# EAGLE design Qwiic_ADC (EAGLE 9.0.1)
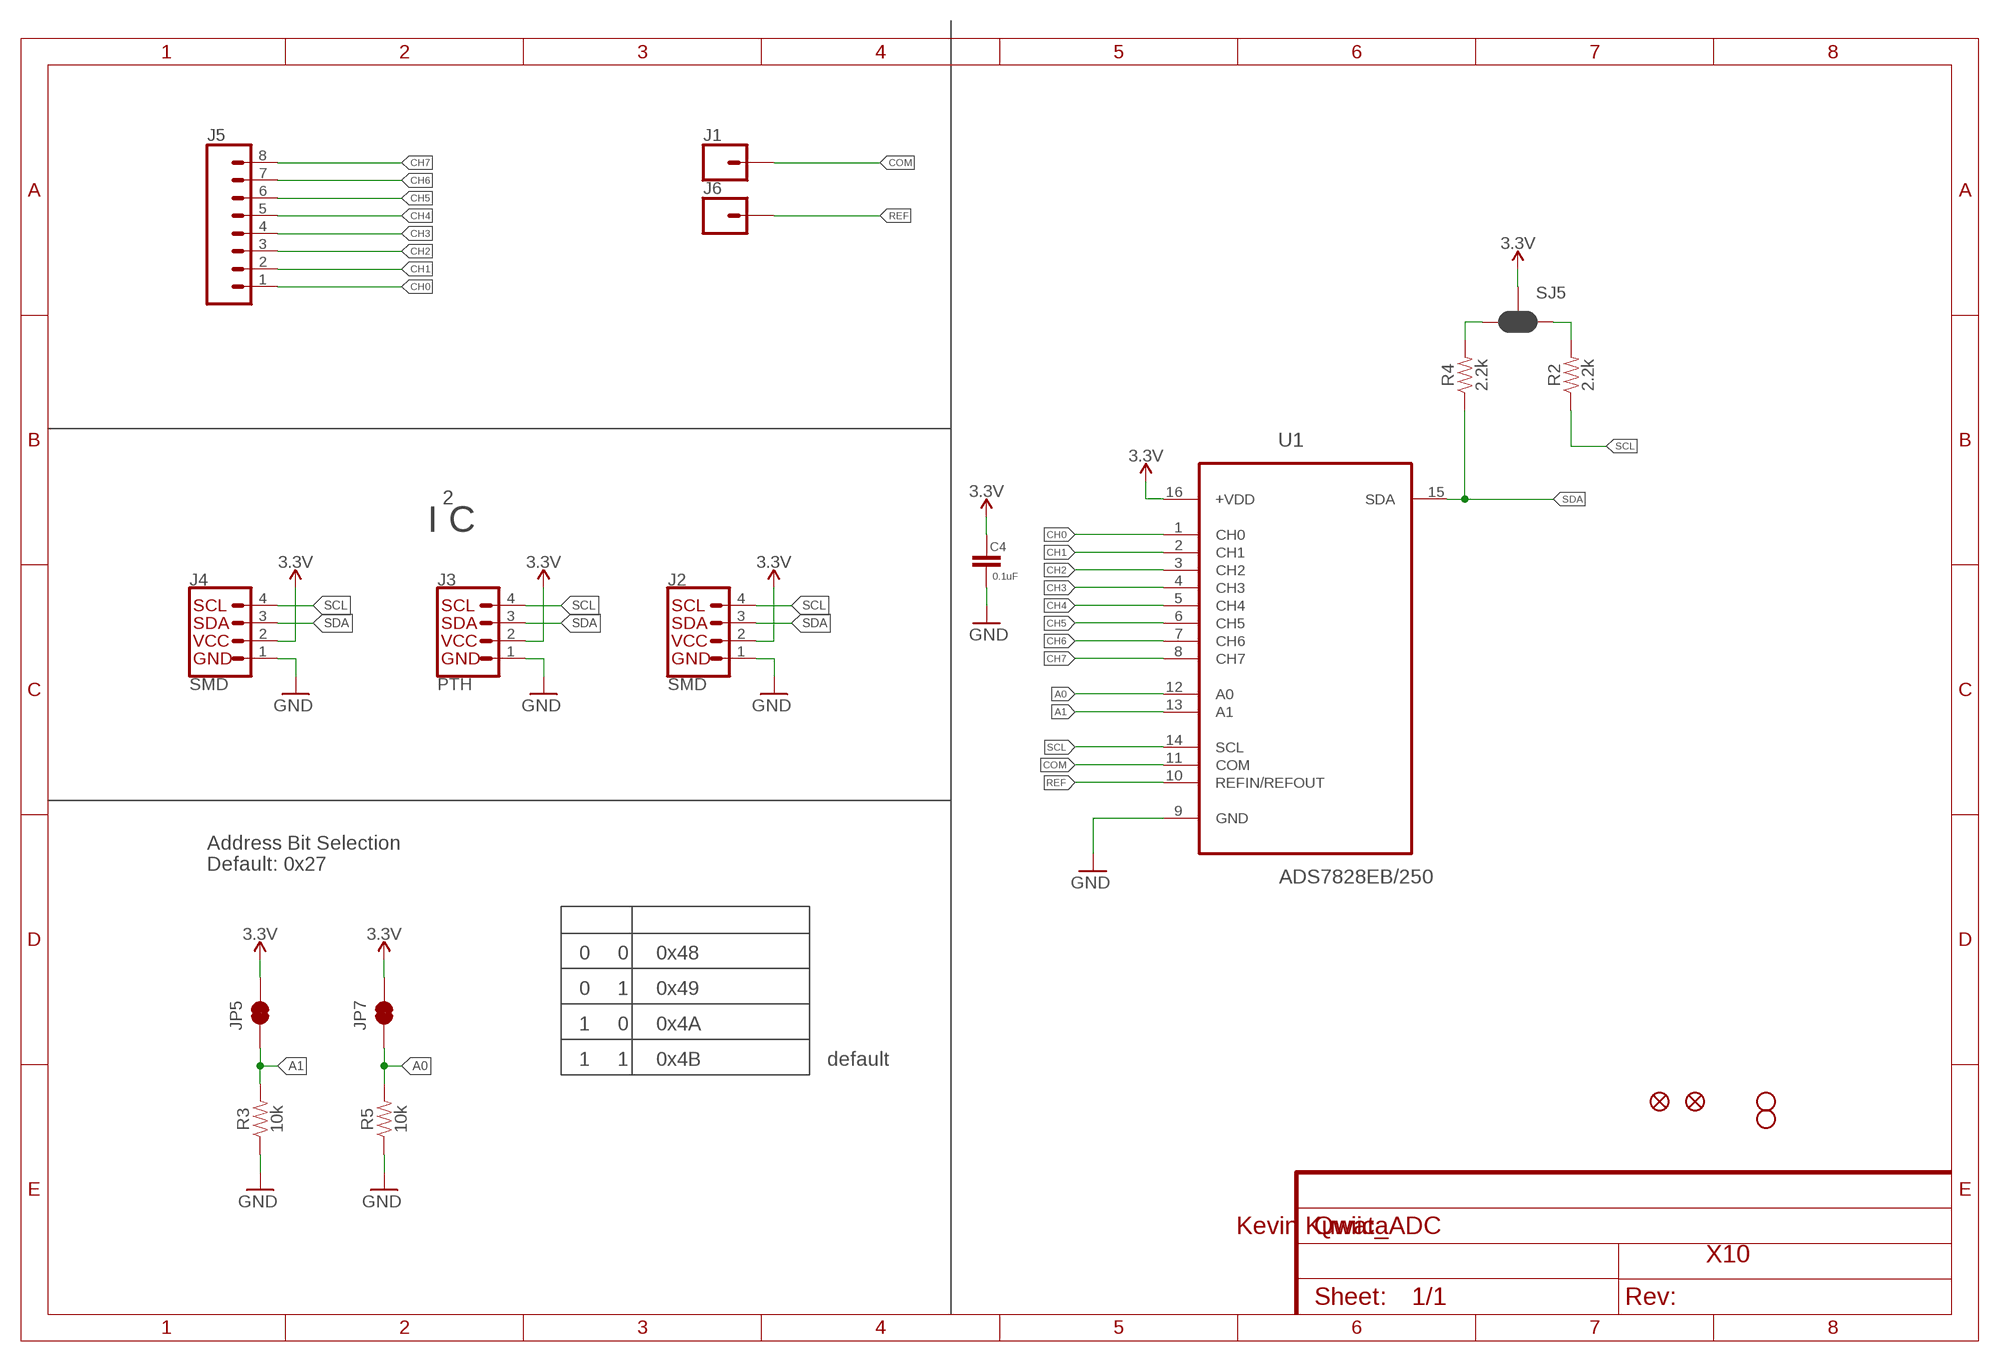
[diagram p0: schematic, sheet 1]

## Parts
C4  0.1uF  0.1UF-0603-25V-(+80/-20%)  [0603]
J1  CONN_01PTH_NO_SILK_YES_STOP  [1X01_NO_SILK]
J2  SMD  I2C_STANDARDJS-1MM  [1X04_1MM_RA]
J3  PTH  I2C_STANDARD_NO_SILK  [1X04_NO_SILK]
J4  SMD  I2C_STANDARDJS-1MM  [1X04_1MM_RA]
J5  CONN_08NO_SILK_FEMALE_PTH  [1X08_NO_SILK]
J6  CONN_01PTH_NO_SILK_YES_STOP  [1X01_NO_SILK]
JP2  FIDUCIALUFIDUCIAL  [MICRO-FIDUCIAL]
JP3  STAND-OFF  [STAND-OFF]
JP4  STAND-OFF  [STAND-OFF]
JP5  JUMPER-SMT_2_NC_TRACE_NO-SILK  [SMT-JUMPER_2_NC_TRACE_NO-SILK]
JP6  FIDUCIALUFIDUCIAL  [MICRO-FIDUCIAL]
JP7  JUMPER-SMT_2_NC_TRACE_NO-SILK  [SMT-JUMPER_2_NC_TRACE_NO-SILK]
R2  2.2k  2.2KOHM-0603-1/10W-1%  [0603]
R3  10k  2.2KOHM-0603-1/10W-1%  [0603]
R4  2.2k  2.2KOHM-0603-1/10W-1%  [0603]
R5  10k  2.2KOHM-0603-1/10W-1%  [0603]
SJ5  SMT-JUMPER-_3-2-NC-PASTE_TALL  [SMT-JUMPER_3-2-NC-PASTE_SILK_TALLER_A]
U1  ADS7828EB/250  [SOP65P640X120-16N]

## Nets
3.3V: C4.1 J2.2(VCC) J3.2(VCC) J4.2(VCC) JP5.2 JP7.2 SJ5.2 U1.16(+VDD)
A0: JP7.1 R5.2 U1.12(A0)
A1: JP5.1 R3.2 U1.13(A1)
CH0: J5.1 U1.1(CH0)
CH1: J5.2 U1.2(CH1)
CH2: J5.3 U1.3(CH2)
CH3: J5.4 U1.4(CH3)
CH4: J5.5 U1.5(CH4)
CH5: J5.6 U1.6(CH5)
CH6: J5.7 U1.7(CH6)
CH7: J5.8 U1.8(CH7)
COM: J1.1 U1.11(COM)
GND: C4.2 J2.1(GND) J3.1(GND) J4.1(GND) R3.1 R5.1 U1.9(GND)
REF: J6.1 U1.10(REFIN/REFOUT)
SCL: J2.4(SCL) J3.4(SCL) J4.4(SCL) R2.1 U1.14(SCL)
SCL_PU1: R2.2 SJ5.1
SDA: J2.3(SDA) J3.3(SDA) J4.3(SDA) R4.1 U1.15(SDA)
SDA_PU1: R4.2 SJ5.3

## Notes on the sheet
- 2
- I C
- Address Bit Selection
  Default: 0x27
- 0     0     0x48
- 0     1     0x49
- 1     0     0x4A
- 1     1     0x4B | default
- Kevin Kuwata
- X10

## Library data of the parts
C4 = SparkFun-Capacitors:0.1UF: 0.1µF ceramic capacitors A capacitor is a passive two-terminal electrical component used to store electrical energy temporarily in an electric field.; PROD_ID: CAP-00810
J1 J6 = SparkFun-Connectors:CONN_01: Single connection point. Often used as Generic Header-pin footprint for 0.1 inch spaced/style header connections On any of the 0.1 inch spaced packages, you can populate with these: Break Away Headers - Straight <https://www.sparkfun.com/products/116> (PRT-00116) Break Away Male Headers - Right Angle <https://www.sparkfun.com/products/553> (PRT-00553) Female Headers <https://www.sparkfun.com/products/115> (PRT-00115) Break Away Headers - Machine Pin <https://www.sparkfun.com/products/117> (PRT-00117) Break Away Female Headers - Swiss Machine Pin <https://www.sparkfun.com/products/743> (PRT-00743) This device is also useful as a general connection point to wire up your design to another part of your project. Our various solder wires solder well into these plated through hole pads. Hook-Up Wire - Assortment (Stranded, 22 AWG) <https://www.sparkfun.com/products/11375> (PRT-11375) Hook-Up Wire - Assortment (Solid Core, 22 AWG) <https://www.sparkfun.com/products/11367> (PRT-11367) View the entire wire category on our website here <https://www.sparkfun.com/categories/141> Special notes: SMTSO-256-ET is a "flush mount" nut for a 4-40 screw. We mostly use this on specialty testbeds; it is a nice way to connect hardware to your PCB at an adjustable hieght. Also note, the SNAP packages are for using a snappable style connector. We sell a baggie of snaps and they are also used on two LilyPad designs: Snap Assortment - 30 pack (male and female) <https://www.sparkfun.com/products/11347> (DEV-11347) LilyPad Arduino SimpleSnap <https://www.sparkfun.com/products/10941> (DEV-10941) LilyPad SimpleSnap Protoboard <https://www.sparkfun.com/products/10940> (DEV-10940)
J2-J4 = SparkX:I2C_STANDARD: SparkFun I2C Standard Pinout Header SparkFun has standardized on a pinout for all I2C based sensor breakouts. This pinout allows I2C boards to be plugged directly into the headers on Arduino Uno compatible boards, and to be daisy chained easily. Example SparkFun Products: SparkFun Atmospheric Sensor Breakout - BME280 <https://www.sparkfun.com/products/13676> SparkFun Altitude/Pressure Sensor Breakout - MPL3115A2 <https://www.sparkfun.com/products/11084> SparkFun TOF Range Finder Sensor - VL6180 <https://www.sparkfun.com/products/12785>
J5 = SparkFun-Connectors:CONN_08: Multi connection point. Often used as Generic Header-pin footprint for 0.1 inch spaced/style header connections On any of the 0.1 inch spaced packages, you can populate with these: Break Away Headers - Straight <https://www.sparkfun.com/products/116> (PRT-00116) Break Away Male Headers - Right Angle <https://www.sparkfun.com/products/553> (PRT-00553) Female Headers <https://www.sparkfun.com/products/115> (PRT-00115) Break Away Headers - Machine Pin <https://www.sparkfun.com/products/117> (PRT-00117) Break Away Female Headers - Swiss Machine Pin <https://www.sparkfun.com/products/743> (PRT-00743) Arduino Stackable Header - 8 Pin <https://www.sparkfun.com/products/9279> (PRT-09279) For SCREWTERMINALS and SPRING TERMINALS visit here: Screw Terimnals on SparkFun.com <https://www.sparkfun.com/search/results?term=Screw+Terminals> (5mm/3.5mm/2.54mm spacing) This device is also useful as a general connection point to wire up your design to another part of your project. Our various solder wires solder well into these plated through hole pads. Hook-Up Wire - Assortment (Stranded, 22 AWG) <https://www.sparkfun.com/products/11375> (PRT-11375) Hook-Up Wire - Assortment (Solid Core, 22 AWG) <https://www.sparkfun.com/products/11367> (PRT-11367) View the entire wire category on our website here <https://www.sparkfun.com/categories/141> Special notes: Molex polarized connector foot print use with SKU : PRT-08231 with associated crimp pins and housings. 1MM SMD Version SKU: PRT-10208 NOTES ON THE VARIANTS LOCK and LOCK_LONGPADS... This footprint was designed to help hold the alignment of a through-hole component (i.e. 6-pin header) while soldering it into place. You may notice that each hole has been shifted either up or down by 0.005 of an inch from it's more standard position (which is a perfectly straight line). This slight alteration caused the pins (the squares in the middle) to touch the edges of the holes. Because they are alternating, it causes a "brace" to hold the component in place. 0.005 has proven to be the perfect amount of "off-center" position when using our standard breakaway headers. Although looks a little odd when you look at the bare footprint, once you have a header in there, the alteration is very hard to notice. Also,if you push a header all the way into place, it is covered up entirely on the bottom side.; PROD_ID: CONN-08438
JP2 JP6 = SparkFun:FIDUCIAL: Fiducial Alignment Points Various fiducial points for machine vision alignment.
JP3 JP4 = SparkFun:STAND-OFF: Stand Off This is the mechanical footprint for a #4 phillips button head screw. Use the keepout ring to avoid running the screw head into surrounding components. SKU : PRT-00447
JP5 JP7 = SparkFun-Jumpers:JUMPER-SMT_2_NC_TRACE: Normally closed trace jumper This jumper has a trace between two pads so it's normally closed (NC). Use a razor knife to open the connection. For best results follow the IPC guidelines for cutting traces: Cutout at least 0.063 mm (0.005 in). Remove all loose material to clean up the cut area. Seal the cut with an approved epoxy. Reapply solder to reclose the connection.
R2 R4 = SparkFun-Resistors:2.2KOHM: 2.2kΩ resistor A resistor is a passive two-terminal electrical component that implements electrical resistance as a circuit element. Resistors act to reduce current flow, and, at the same time, act to lower voltage levels within circuits. - Wikipedia; PROD_ID: RES-08272
R3 R5 = SparkFun-Resistors:2.2KOHM: 2.2kΩ resistor A resistor is a passive two-terminal electrical component that implements electrical resistance as a circuit element. Resistors act to reduce current flow, and, at the same time, act to lower voltage levels within circuits. - Wikipedia; PROD_ID: RES-08272; VALUE: 2.2k
SJ5 = KevinKuwata_eagle:SMT-JUMPER-_3-2-NC-PASTE
U1 = ADS7828EB_250:ADS7828EB/250: ADC; AVAILABILITY: Unavailable; MF: Texas; MP: ADS7828EB/250; PACKAGE: TSSOP-16 Texas; PRICE: None

## Board
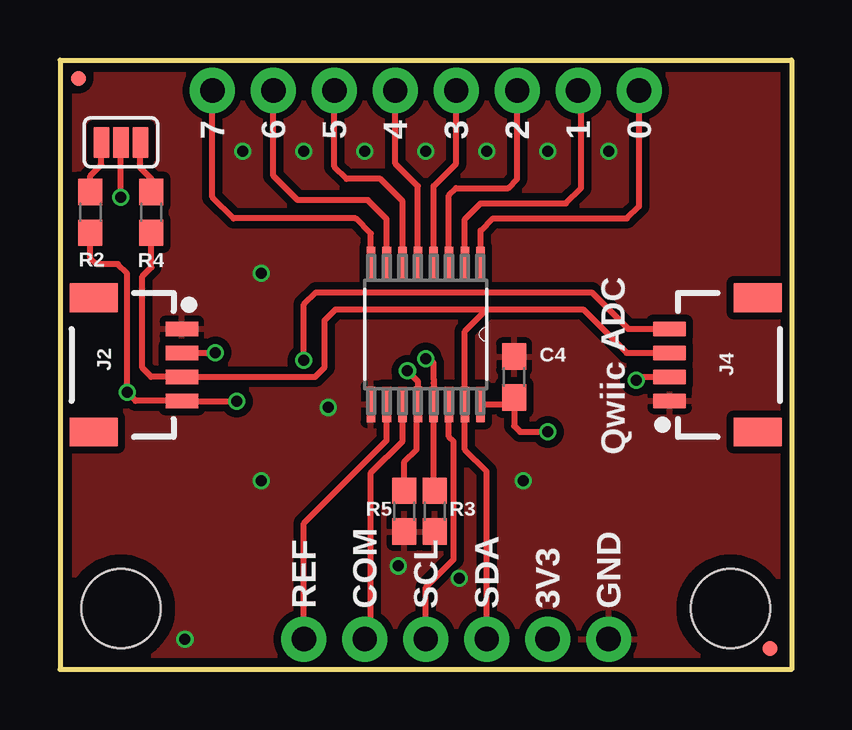
[diagram p1: board, top side]
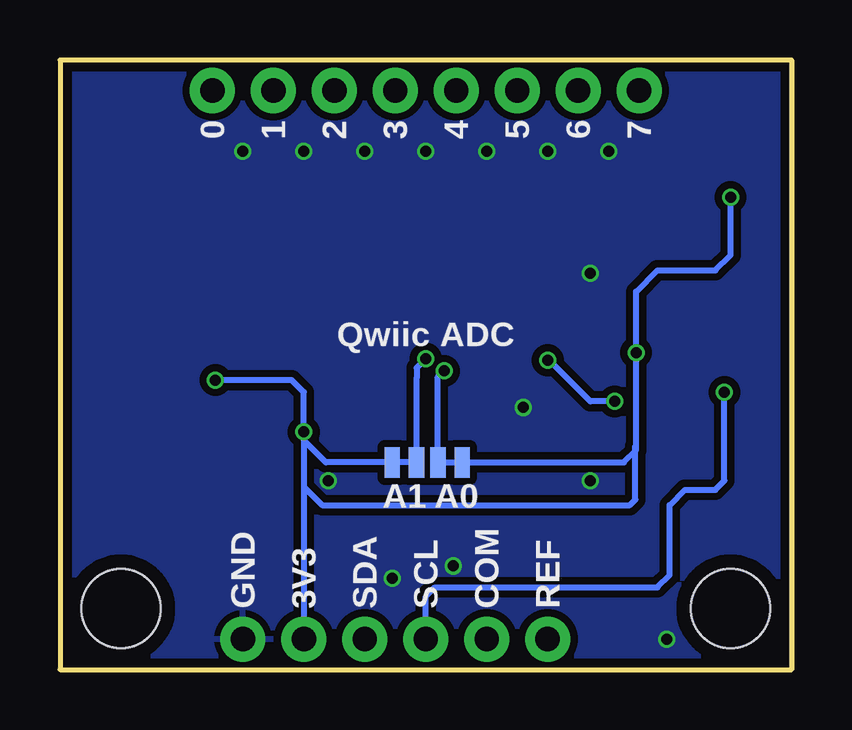
[diagram p2: board, bottom side, seen from below]

Size 30.48 x 25.4 mm. Coordinates in mm from the lower left corner, seen from the top.
Outline: 0,25.4 30.48,25.4 30.48,0 0,0 0,25.4
Copper layers (1*16): Top 0.035559375mm / dielectric 1.6mm / Bottom 0.035559375mm
Design rules "oshpark-2layer": minimum track width 6mil, minimum drill 10mil, track to track 6mil, track to pad 6mil, pad to pad 6mil, via to via 6mil, smd to smd 6mil, copper to edge 15mil, drill to drill 6mil, minimum pad ring 5mil, minimum via ring 5mil, stop-mask expansion 2.5mil, vias tented up to drill 0mil, thermal gap 10mil

### Footprints (pad centres in the part's own frame; a part is rotated, then mirrored left to right if it is on the bottom)
0603 = smd 1.1 x 1: 1 -0.85,0; 2 0.85,0
1X01_NO_SILK = drill 1.016 pad 1.88: 1 0,0
1X04_1MM_RA = smd 0.6 x 1.35: 1 -1.5,0; 2 -0.5,0; 3 0.5,0; 4 1.5,0 | smd 1.2 x 2: NC1 2.8,-3.675; NC2 -2.8,-3.675
1X04_NO_SILK = drill 1.016 pad 1.88: 1 0,0; 2 2.54,0; 3 5.08,0; 4 7.62,0
1X08_NO_SILK = drill 1.016 pad 1.88: 1 0,0; 2 2.54,0; 3 5.08,0; 4 7.62,0; 5 10.16,0; 6 12.7,0; 7 15.24,0; 8 17.78,0
MICRO-FIDUCIAL = smd 0.635 x 0.635: 1 0,0
STAND-OFF = hole 3.302: 0,0
SMT-JUMPER_2_NC_TRACE_NO-SILK = smd 0.635 x 1.27: 1 -0.508,0; 2 0.508,0
SMT-JUMPER_3-2-NC-PASTE_SILK_TALLER_A = smd 0.635 x 1.27: 1 -0.813,0; 2 0,0; 3 0.813,0
SOP65P640X120-16N = smd 1.473 x 0.356: 1 -2.921,2.286; 2 -2.921,1.626; 3 -2.921,0.965; 4 -2.921,0.33; 5 -2.921,-0.33; 6 -2.921,-0.965; 7 -2.921,-1.626; 8 -2.921,-2.286; 9 2.921,-2.286; 10 2.921,-1.626; 11 2.921,-0.965; 12 2.921,-0.33; 13 2.921,0.33; 14 2.921,0.965; 15 2.921,1.626; 16 2.921,2.286

### Placement (x,y rotation side)
C4  18.92,12.19 90 top
J1  12.7,1.27 0 top
J2  5.08,12.7 270 top
J3  22.86,1.27 180 top
J4  25.4,12.7 90 top
J5  24.13,24.13 180 top
J6  10.16,1.27 0 top
JP2  29.59,0.89 0 top
JP3  2.54,2.54 0 top
JP4  27.94,2.54 0 top
JP5  16.13,8.64 180 bottom
JP6  0.76,24.64 0 top
JP7  14.22,8.64 0 bottom
R2  1.27,19.05 90 top
R3  15.62,6.6 90 top
R4  3.81,19.05 90 top
R5  14.35,6.6 90 top
SJ5  2.54,21.97 0 top
U1  15.24,13.97 270 top

### Tracks (layer width: path | path; a pad name or v marks a point on that pad's centre or on a via)
3.3V  (via drill 0.46)
  Top 0.254: J2.2 v6.47,13.2 v6.48,13.21 | v2.54,19.68 SJ5.2 | U1.16 18.63,11.05 C4.1 18.92,10.16 19.18,9.91 v20.32,9.91 | v24,12.06 24.14,12.2 J4.2
  Bottom 0.254: 20.32,9.55 v20.32,9.91 20.32,11.56 20.83,12.06 v24,12.06 | 20.32,9.55 20.32,7.62 | 20.32,7.62 J3.2 | 6.48,9.35 6.48,9.14 6.99,8.64 JP7.2 | 6.48,9.35 v6.48,13.21 6.48,15.75 5.59,16.64 3.17,16.64 2.54,17.27 v2.54,19.68 | 20.32,9.55 19.41,8.64 JP5.2 | 20.32,7.62 19.56,6.86 6.73,6.86 6.5,7.09 6.5,9.32 6.48,9.35
A0  (via drill 0.46)
  Top 0.254: 14.86,11 14.86,9.17 14.35,8.66 R5.2 | 14.86,11 U1.12 14.91,12.01 v14.48,12.45 | 14.83,11.03 14.86,11
  Bottom 0.254: JP7.1 14.73,12.19 v14.48,12.45
A1  (via drill 0.46)
  Top 0.254: R3.2 15.57,7.5 U1.13 15.57,11.94 15.57,12.12 15.57,12.78 15.29,13.06 15.24,13.01 v15.24,12.95
  Bottom 0.254: JP5.1 15.62,11.86 15.62,12.14 15.62,12.57 v15.24,12.95
CH0
  Top 0.254: U1.1 17.53,18.29 18.03,18.8 23.62,18.8 24.13,19.3 J5.1
CH1
  Top 0.254: U1.2 16.87,18.77 17.53,19.43 21.08,19.43 21.72,20.07 21.72,24 J5.2
CH2
  Top 0.254: U1.3 16.2,19.76 16.51,20.07 18.67,20.07 19.05,20.45 J5.3
CH3
  Top 0.254: U1.4 15.57,20.14 16.51,21.08 J5.4
CH4
  Top 0.254: U1.5 14.91,20.14 13.97,21.08 J5.5
CH5
  Top 0.254: U1.6 14.28,19.51 13.34,20.45 11.94,20.45 11.43,20.95 J5.6
CH6
  Top 0.254: J5.7 8.89,20.57 9.91,19.56 12.83,19.56 13.61,18.77 U1.7
CH7
  Top 0.254: J5.8 6.35,19.68 7.24,18.8 12.32,18.8 12.95,18.16 U1.8
COM
  Top 0.254: J1.1 12.95,1.52 12.95,8.2 14.28,9.52 U1.11
GND  (via drill 0.46)
  other vias: 7.62,21.59 10.16,21.59 12.7,21.59 15.24,21.59 17.78,21.59 20.32,21.59 22.86,21.59 16.64,3.81 14.1,4.32 5.21,1.27 11.18,10.92 8.38,7.87 19.3,7.87 8.38,16.51
  pour Bottom (isolate 0.305): 0,0 0,25.4 30.48,25.4 30.48,0
  pour Top (isolate 0.305): 0,0 0,25.4 30.48,25.4 30.48,0
REF
  Top 0.254: J6.1 10.16,6.1 13.61,9.55 U1.10
SCL  (via drill 0.46)
  Top 0.254: R2.1 1.27,17.14 1.52,16.89 2.41,16.89 2.79,16.51 v2.79,11.56 3.15,11.2 J2.4 5.1,11.18 v7.37,11.18 | 16.26,11 U1.14 16.2,9.7 16.4,9.51 16.4,4.59 15.24,3.43 J3.4 | v10.16,12.89 10.16,15.21 10.67,15.72 22.15,15.72 23.67,14.2 J4.4
  Bottom 0.254: v7.37,11.18 8.38,11.18 10.09,12.89 v10.16,12.89 | J3.4 15.24,3.05 14.86,3.43 5.59,3.43 5.08,3.94 5.08,6.86 4.45,7.49 3.17,7.49 2.79,7.87 v2.79,11.56
SCL_PU1
  Top 0.254: R2.2 1.27,20.57 1.73,21.03 SJ5.1
SDA
  Top 0.254: R4.1 3.81,16.76 3.43,16.38 3.43,12.57 3.8,12.2 J2.3 10.62,12.2 11.02,12.6 11.02,14.55 11.48,15.01 17.78,15.01 | J3.3 17.78,8.26 16.87,9.17 U1.15 16.87,14.1 17.78,15.01 | 17.78,15.01 21.79,15.01 23.61,13.2 J4.3
SDA_PU1
  Top 0.254: R4.2 3.81,20.45 3.35,20.9 SJ5.3

### Text on the board
tPlace: 7 | 6 | 5 | 4 | 3 | 2 | 1 | 0 | Qwiic ADC | REF | COM | SCL | SDA | 3V3 | GND
bPlace: 7 | 6 | 5 | 4 | 3 | 2 | 1 | 0 | Qwiic ADC | A0 | A1 | REF | COM | SCL | SDA | 3V3 | GND